# EAGLE schematic sdc schematic v3.1 (EAGLE 9.6.2)
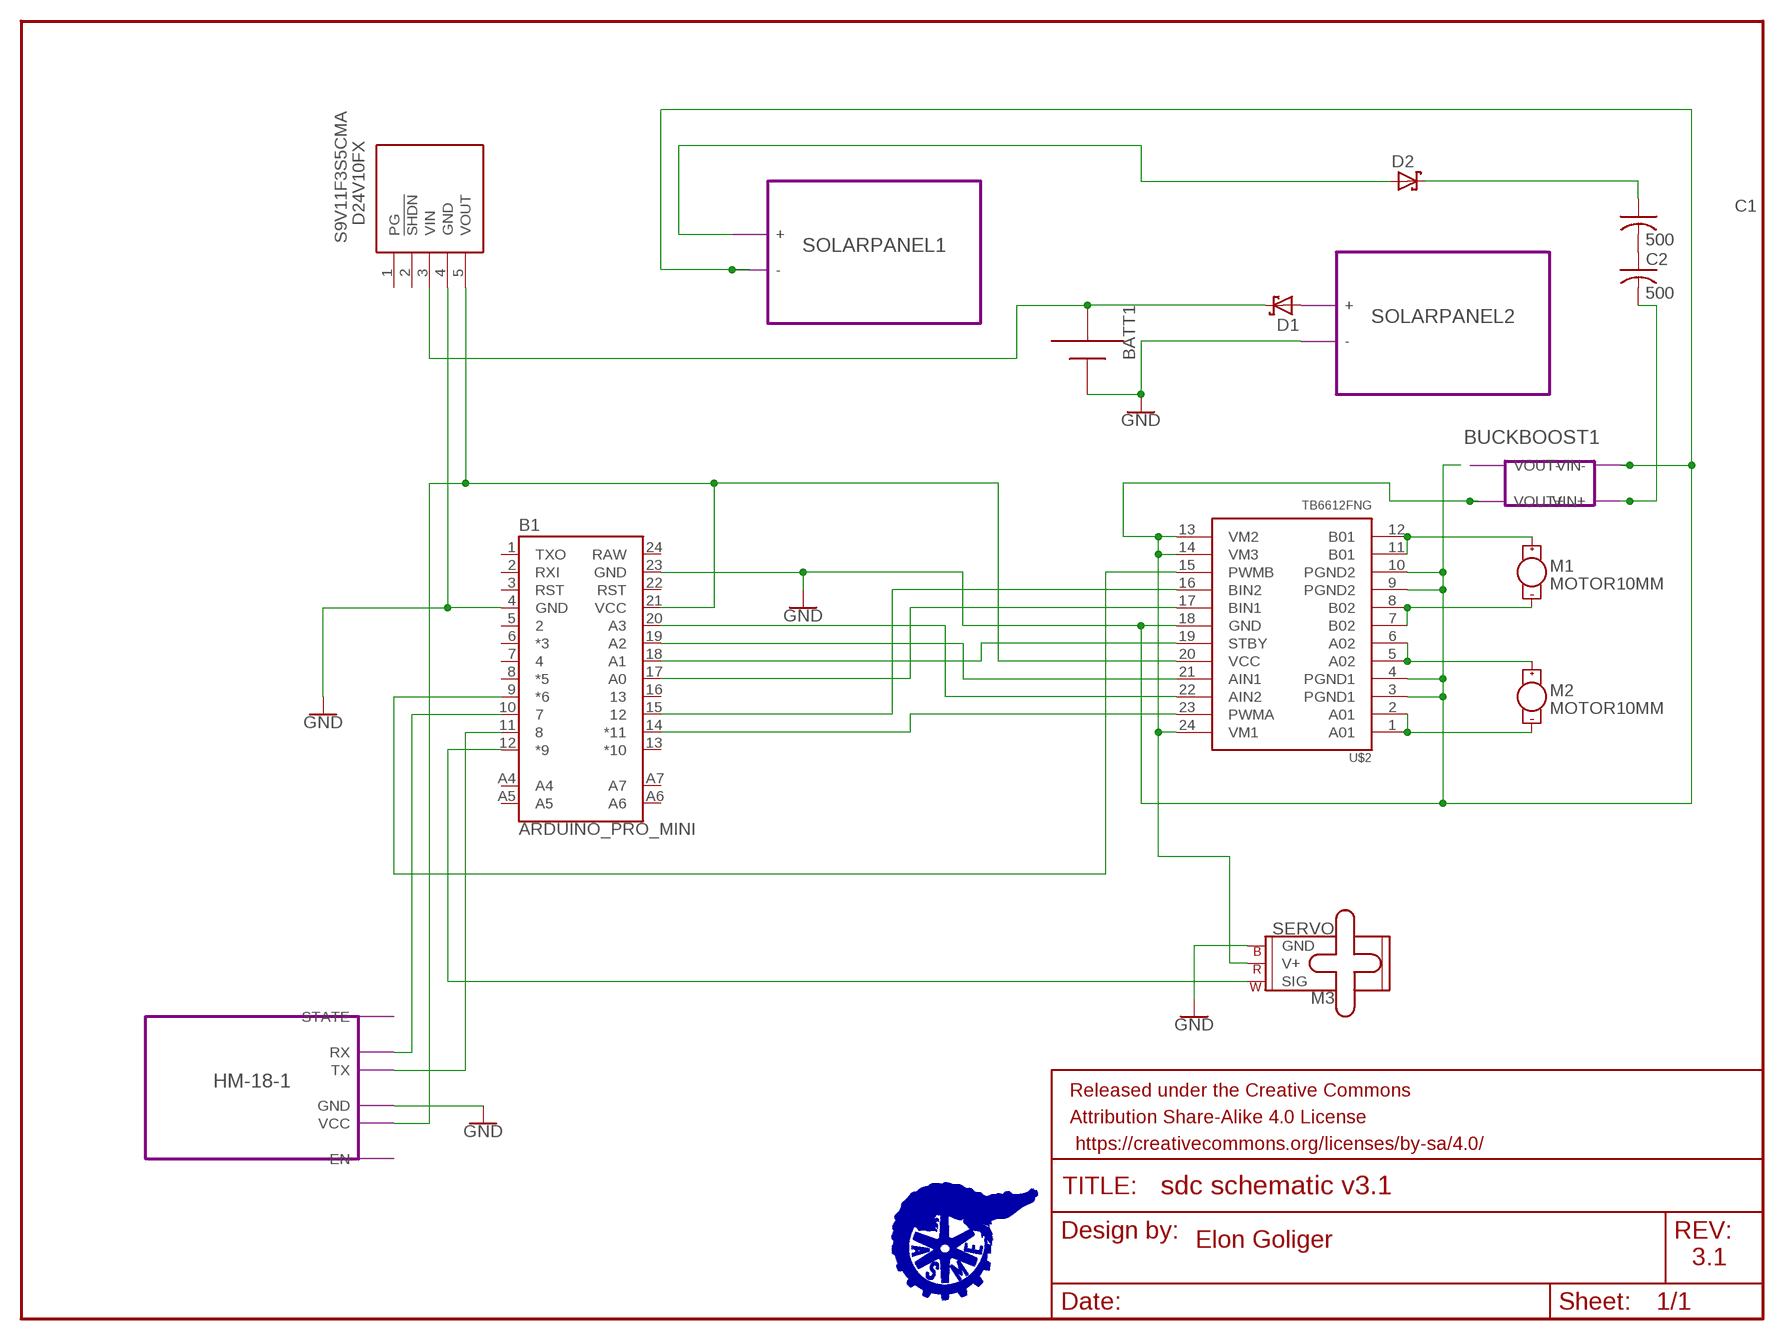
[diagram p0: schematic, sheet 1]

## Parts
B1  ARDUINO_PRO_MINI  [ARDUINO_PRO_MINI]
BATT1  AAA  [12BH412]
C1  500  C-US325-182X374  [C325-182X374]
C2  500  C-US325-182X374  [C325-182X374]
D1  SCHOTTKY-DIODEDO35-7  [DO35-7]
D2  SCHOTTKY-DIODEDO35-7  [DO35-7]
FRAME1  FRAME-LETTER  [CREATIVE_COMMONS]
M1  MOTOR10MM  [VIBE-MOTOR-10MM]
M2  MOTOR10MM  [VIBE-MOTOR-10MM]
M3  SERVO  [1X03]
S9V11F3S5CMA  D24V10FX  [D24V10FX]
U$2  TB6612FNG  [SSOP24]

## Module instances
SOLARPANEL1 = SOLARPANEL
HM-18-1 = HM-18
SOLARPANEL2 = SOLARPANEL
BUCKBOOST1 = BUCKBOOST

## Nets
GND: B1.4(GND) B1.23(GND) BATT1.+ M3.3(GND) S9V11F3S5CMA.4(GND) U$2.3(PGND1) U$2.4(PGND1) U$2.9(PGND2) U$2.10(PGND2) U$2.18(GND) ; port SOLARPANEL2.- SOLARPANEL1.- BUCKBOOST1.VIN- HM-18-1.GND
N$1: B1.14(*11) U$2.23(PWMA)
N$2: B1.9(*6) U$2.15(PWMB)
N$3: C1.2 C2.1
N$4: B1.20(A3) U$2.22(AIN2)
N$5: B1.19(A2) U$2.21(AIN1)
N$6: B1.10 ; port HM-18-1.RX
N$7: B1.17(A0) U$2.17(BIN1)
N$8: B1.15 U$2.16(BIN2)
N$9: B1.11 ; port HM-18-1.TX
N$10: M1.+ U$2.11(B01) U$2.12(B01)
N$11: M1.- U$2.7(B02) U$2.8(B02)
N$12: B1.12(*9) M3.1(SIG)
N$13: M3.2(V+) U$2.13(VM2) U$2.14(VM3) U$2.24(VM1) ; port BUCKBOOST1.VOUT+
N$14: M2.+ U$2.5(A02) U$2.6(A02)
N$15: M2.- U$2.1(A01) U$2.2(A01)
N$17: D2.A ; port SOLARPANEL1.+
N$18: B1.18(A1) U$2.19(STBY)
N$19: D1.A ; port SOLARPANEL2.+
N$20: C2.2 ; port BUCKBOOST1.VIN+
N$21: B1.21(VCC) S9V11F3S5CMA.5(VOUT) U$2.20(VCC) ; port HM-18-1.VCC
N$25: BATT1.- D1.C S9V11F3S5CMA.3(VIN)
N$28: C1.1 D2.C
Unconnected: B1.1(TXO) B1.2(RXI) B1.3(RST) B1.5 B1.6(*3) B1.7 B1.8(*5) B1.13(*10) B1.16 B1.22(RST) B1.A4 B1.A5 B1.A6 B1.A7 S9V11F3S5CMA.1(PG) S9V11F3S5CMA.2(!SHDN)

## Notes on the sheet
- Elon Goliger
- 3.1

## Power pins joined to a net without a drawn wire
RAW: B1.24(RAW)

## Library data of the parts
B1 = SparkFun-Boards:ARDUINO_PRO_MINI: SparkFun Pro Mini Pro Mini compatible footprint. Dimensions: 0.7 x 1.3" PCB Thickness: 0.8mm SparkFun Products: 3.3V/8MHz <https://www.sparkfun.com/products/11114> 5V/16MHz <https://www.sparkfun.com/products/11113>
BATT1 = adafruit:AAA: AAA PC pin holder Mouser part #12BH412 - but pretty much any 1x AAA battery holder should be the same http://www.ladyada.net/library/pcb/eaglelibrary.html
C1 C2 = rcl:C-US: CAPACITOR, American symbol; SPICEPREFIX: C
D1 D2 = adafruit:SCHOTTKY-DIODE: Schottky Diode
FRAME1 = SparkFun-Aesthetics:FRAME-LETTER: Schematic Frame - Letter Standard 8.5x11 US Letter frame
M1 M2 = SparkFun-Electromechanical:MOTOR: Motor (Single-Phase) Two-terminal, single-phase motors. SparkFun Products Vibration Motor <https://www.sparkfun.com/products/8449> (ROB-08449) Physical dimension and wire connections for this powerful vibration motor. Motor has a self adhesive backing.; PROD_ID: COMP-08572; SF_SKU: ROB-08449
M3 = SparkFun-Electromechanical:SERVO: Servo Motor 3-pin connector for a standard servo motor (voltage supply, ground, and control signal.) SparkFun Products Servo - Generic (Sub-Micro Size) <https://www.sparkfun.com/products/9065> (ROB-09065) Servo - Generic High Torque Continuous Rotation (Standard Size) <https://www.sparkfun.com/products/9347> (ROB-09347) Servo - Generic High Torque (Standard Size) <https://www.sparkfun.com/products/11965> (ROB-11965)
S9V11F3S5CMA = SamacSys_Parts:D24V10FX: Pololu 3.3V, 1A Step-Down Voltage Regulator D24V10F3 Source: Datasheet <https://www.pololu.com/product/2830>; DESCRIPTION: Pololu 3.3V, 1A Step-Down Voltage Regulator D24V10F3; HEIGHT: 3.82mm; MANUFACTURER_NAME: POLOLU ROBOTICS & ELECTRONICS; MANUFACTURER_PART_NUMBER: D24V10FX
U$2 = SparkFun-IC-Special-Function:TB6612FNG: Toshiba 1A dual motor driver IC-09363; PROD_ID: IC-09363

## Module SPARKFUN3.3VREGULATOR
Ports: 

### Library data of the parts

## Module SOLARPANEL
Ports: +(io) -(io)

### Library data of the parts

## Module HM-18
Ports: STATE(io) RX(io) TX(io) GND(io) VCC(io) EN(io)

### Library data of the parts

## Module S9V11F3S5CMA
Ports: OUT(io) GND(io) IN(io) EN(io) PG(io) SEL(io) REG20B(io)

### Library data of the parts

## Module BUCKBOOST
Ports: VOUT+(io) VOUT-(io) VIN+(io) VIN-(io)

### Library data of the parts

## Module ADJUSTBOOSTCONVERTER
Ports: 

### Library data of the parts